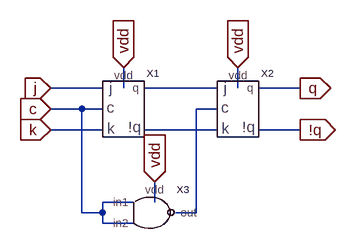
[diagram p0: schematic jk-front-trigger.asc]
jk-front-trigger.asc, the LTspice schematic file:
Version 4
SHEET 1 880 680
WIRE 48 128 -32 128
WIRE 80 128 80 96
WIRE 224 128 112 128
WIRE 256 128 256 96
WIRE 352 128 288 128
WIRE 16 160 -32 160
WIRE 48 160 16 160
WIRE 224 160 192 160
WIRE 48 192 -32 192
WIRE 224 192 112 192
WIRE 352 192 288 192
WIRE 96 304 48 304
WIRE 128 304 128 272
WIRE 16 320 16 160
WIRE 48 320 48 304
WIRE 48 320 16 320
WIRE 192 320 192 160
WIRE 192 320 160 320
WIRE 48 336 48 320
WIRE 96 336 48 336
FLAG 256 96 vdd
IOPIN 256 96 In
FLAG 80 96 vdd
IOPIN 80 96 In
FLAG 352 128 q
IOPIN 352 128 Out
FLAG 352 192 !q
IOPIN 352 192 Out
FLAG -32 128 j
IOPIN -32 128 In
FLAG -32 192 k
IOPIN -32 192 In
FLAG -32 160 c
IOPIN -32 160 In
FLAG 128 272 vdd
IOPIN 128 272 In
SYMBOL jk-trigger 80 160 R0
SYMATTR InstName X1
SYMBOL jk-trigger 256 160 R0
SYMATTR InstName X2
SYMBOL nand 112 320 R0
SYMATTR InstName X3

The netlist it stands for:
* jk-front-trigger.asc
XX1 k c j vdd N003 N001 jk-trigger  ; pins k c j vdd !q q
XX2 N003 N002 N001 vdd !q q jk-trigger  ; pins k c j vdd !q q
XX3 c c N002 vdd nand  ; pins in1 in2 out vdd
.backanno
.end